# Altium schematic sheet CONNECTOR.SchDoc
size 420 x 297 mm; SheetNumber: 2; SheetTotal: 4
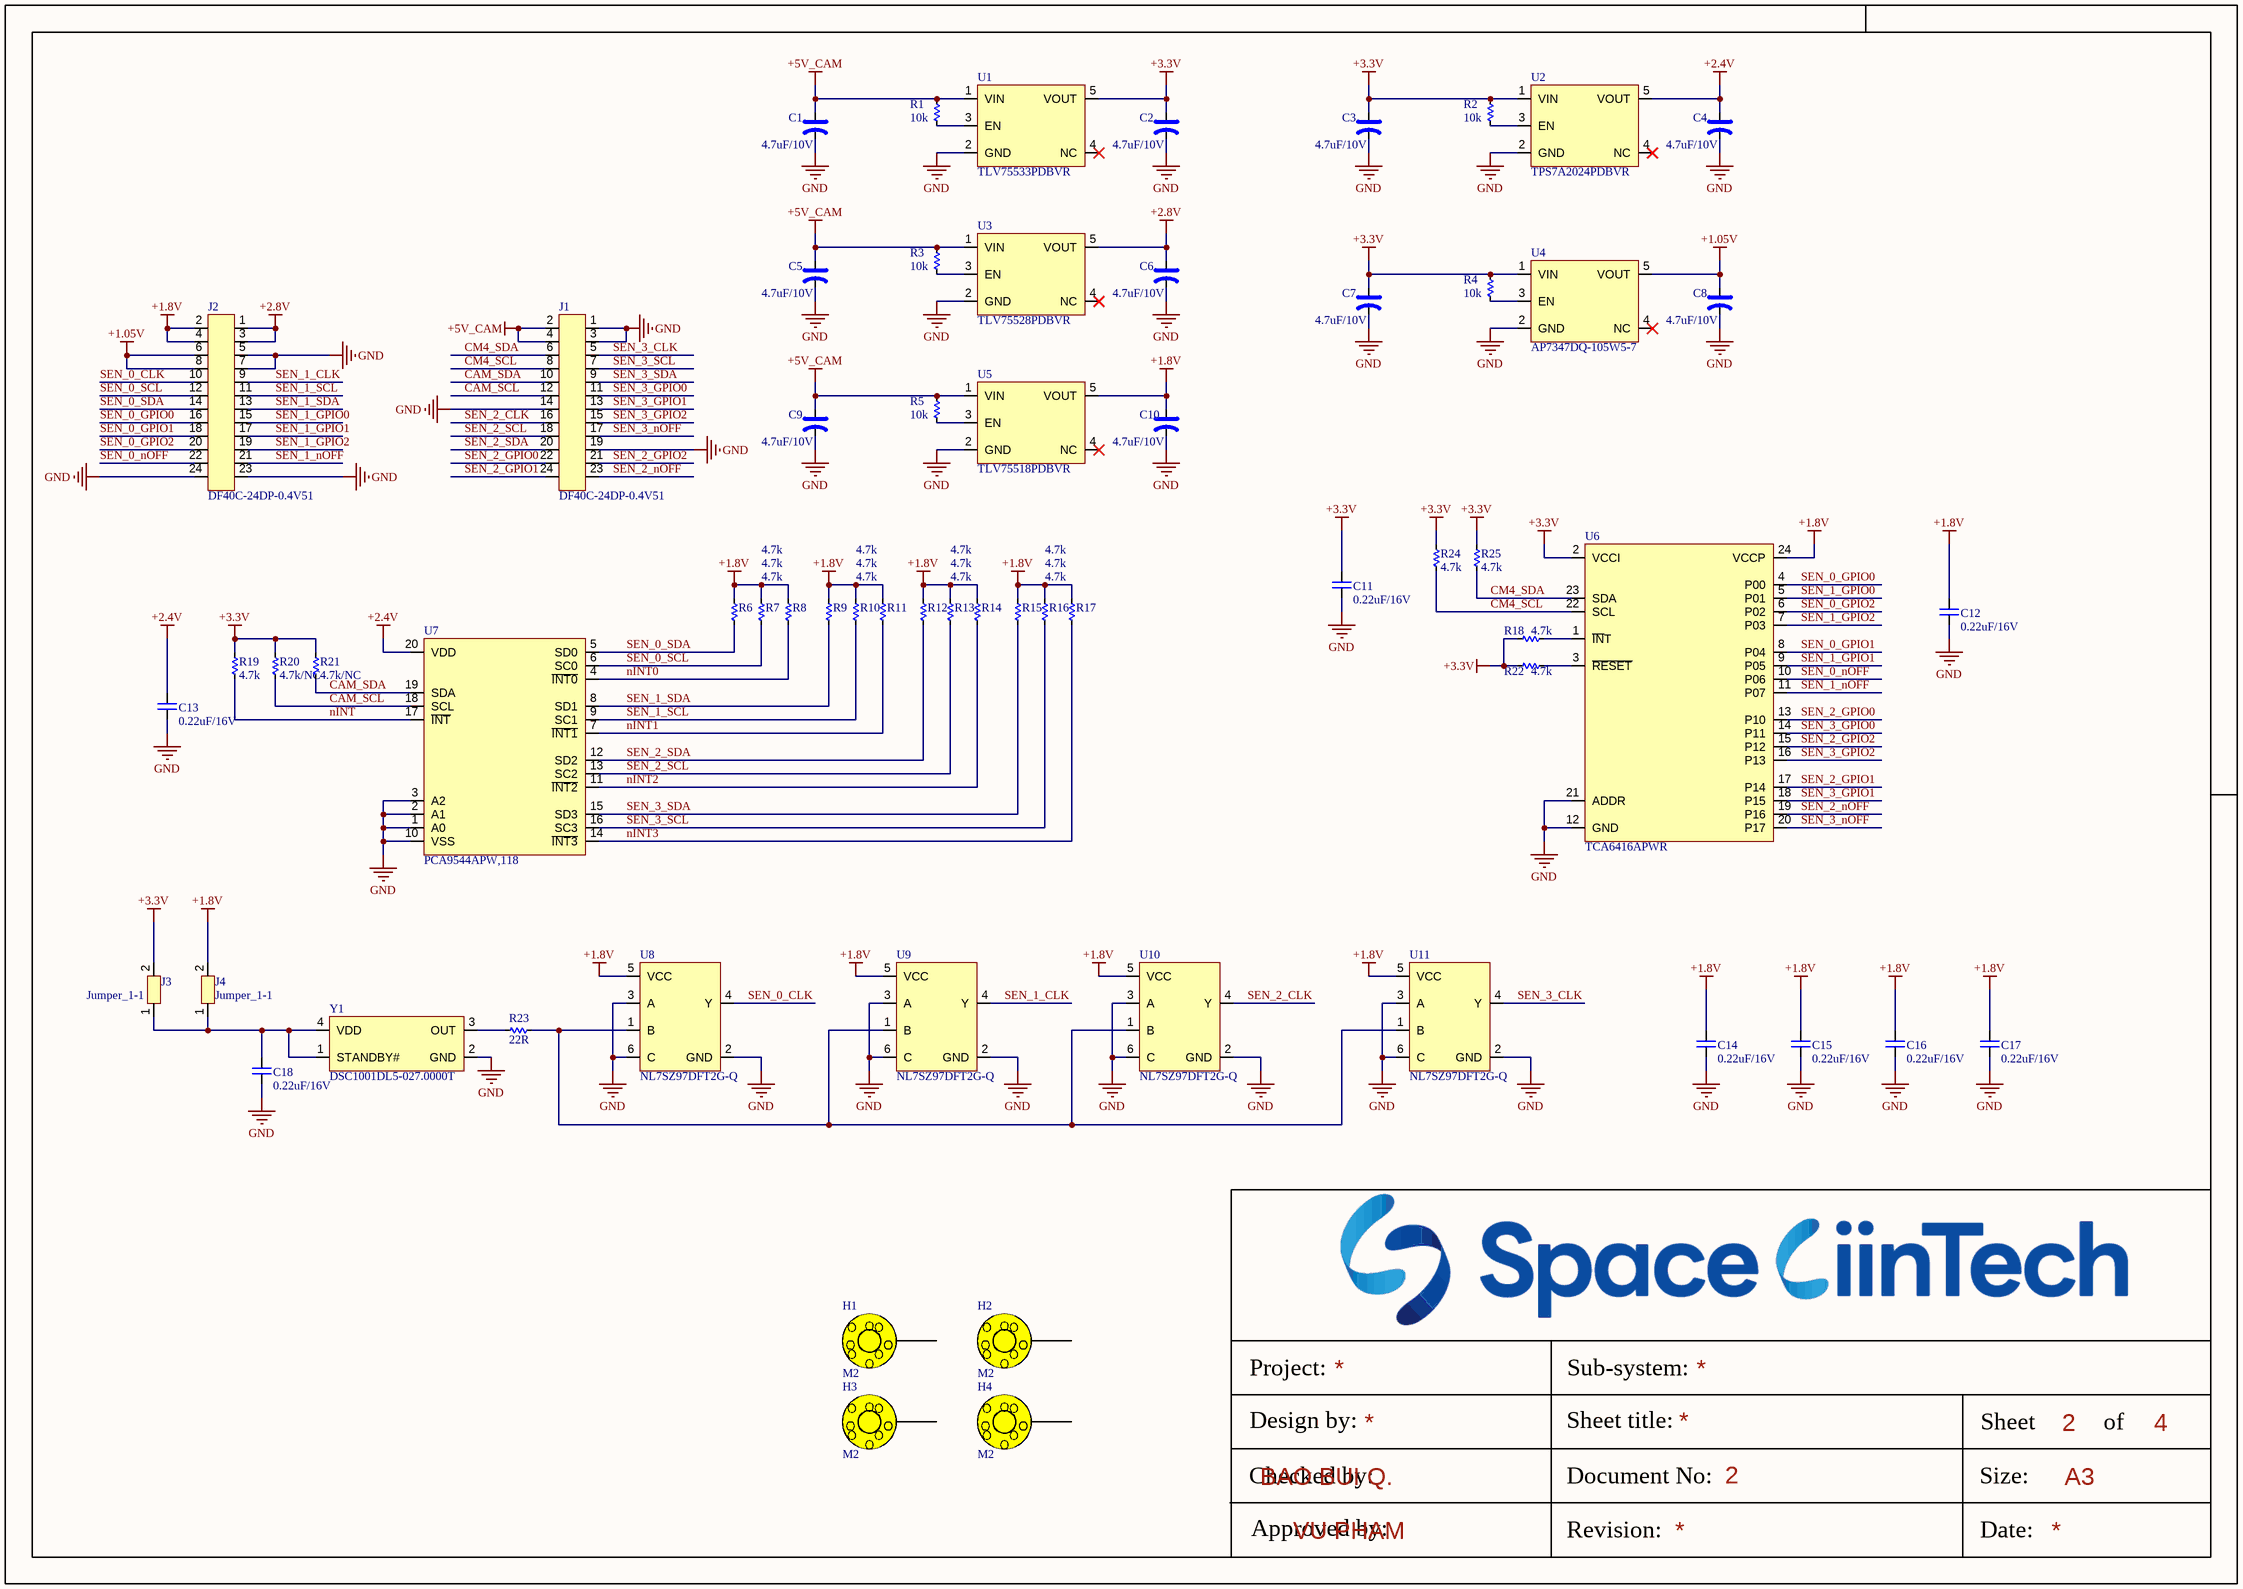
[diagram p0: CONNECTOR.SchDoc]

## Parts
C1  4.7uF/10V  [CAP_MP_1608X90]
C2  4.7uF/10V  [CAP_MP_1608X90]
C3  4.7uF/10V  [CAP_MP_1608X90]
C4  4.7uF/10V  [CAP_MP_1608X90]
C5  4.7uF/10V  [CAP_MP_1608X90]
C6  4.7uF/10V  [CAP_MP_1608X90]
C7  4.7uF/10V  [CAP_MP_1608X90]
C8  4.7uF/10V  [CAP_MP_1608X90]
C9  4.7uF/10V  [CAP_MP_1608X90]
C10  4.7uF/10V  [CAP_MP_1608X90]
C11  0.22uF/16V  [CAP_C_1005X60]
C12  0.22uF/16V  [CAP_C_1005X60]
C13  0.22uF/16V  [CAP_C_1005X60]
C14  0.22uF/16V  [CAP_C_1005X60]
C15  0.22uF/16V  [CAP_C_1005X60]
C16  0.22uF/16V  [CAP_C_1005X60]
C17  0.22uF/16V  [CAP_C_1005X60]
C18  0.22uF/16V  [CAP_C_1005X60]
H1  M2  [HEX-2.2mm]
H2  M2  [HEX-2.2mm]
H3  M2  [HEX-2.2mm]
H4  M2  [HEX-2.2mm]
J1  DF40C-24DP-0.4V51  [CONN24_6p32X1p85_hdr_HIR]
J2  DF40C-24DP-0.4V51  [CONN24_6p32X1p85_hdr_HIR]
J3  Jumper_1-1  [Jumper_1-1]
J4  Jumper_1-1  [Jumper_1-1]
R1  10k  [RES_C_1005X40]
R2  10k  [RES_C_1005X40]
R3  10k  [RES_C_1005X40]
R4  10k  [RES_C_1005X40]
R5  10k  [RES_C_1005X40]
R6  4.7k  [RES_C_1005X40]
R7  4.7k  [RES_C_1005X40]
R8  4.7k  [RES_C_1005X40]
R9  4.7k  [RES_C_1005X40]
R10  4.7k  [RES_C_1005X40]
R11  4.7k  [RES_C_1005X40]
R12  4.7k  [RES_C_1005X40]
R13  4.7k  [RES_C_1005X40]
R14  4.7k  [RES_C_1005X40]
R15  4.7k  [RES_C_1005X40]
R16  4.7k  [RES_C_1005X40]
R17  4.7k  [RES_C_1005X40]
R18  4.7k  [RES_C_1005X40]
R19  4.7k  [RES_C_1005X40]
R20  4.7k/NC  [RES_C_1005X40]
R21  4.7k/NC  [RES_C_1005X40]
R22  4.7k  [RES_C_1005X40]
R23  22R  [RES_C_1005X40]
R24  4.7k  [RES_C_1005X40]
R25  4.7k  [RES_C_1005X40]
U1  TLV75533PDBVR  [SOT25]
U2  TPS7A2024PDBVR  [SOT25]
U3  TLV75528PDBVR  [SOT25]
U4  AP7347DQ-105W5-7  [SOT25]
U5  TLV75518PDBVR  [SOT25]
U6  TCA6416APWR  [SOP65P440W-24N]
U7  PCA9544APW,118  [SOP65P440W_20]
U8  NL7SZ97DFT2G-Q  [SC-88]
U9  NL7SZ97DFT2G-Q  [SC-88]
U10  NL7SZ97DFT2G-Q  [SC-88]
U11  NL7SZ97DFT2G-Q  [SC-88]
Y1  DSC1001DL5-027.0000T  [OSCDFN250X200X89-4N]

## Nets
+1.05V: C8.1 J2.6 J2.8 U4.5(VOUT)
+1.8V: C10.1 C12.2 C14.2 C15.2 C16.2 C17.2 J2.2 J2.4 J4.2 R6.1 R7.1 R8.1 R9.1 R10.1 R11.1 R12.1 R13.1 R14.1 R15.1 R16.1 R17.1 U5.5(VOUT) U6.24(VCCP) U8.5(VCC) U9.5(VCC) U10.5(VCC) U11.5(VCC)
+2.4V: C4.1 C13.2 U2.5(VOUT) U7.20(VDD)
+2.8V: C6.1 J2.1 J2.3 U3.5(VOUT)
+3.3V: C2.1 C3.1 C7.1 C11.2 J3.2 R2.2 R4.2 R18.1 R19.1 R20.1 R21.1 R22.1 R24.1 R25.1 U1.5(VOUT) U2.1(VIN) U4.1(VIN) U6.2(VCCI)
+5V_CAM: C1.1 C5.1 C9.1 J1.2 J1.4 R1.2 R3.2 R5.2 U1.1(VIN) U3.1(VIN) U5.1(VIN)
GND: C1.2 C2.2 C3.2 C4.2 C5.2 C6.2 C7.2 C8.2 C9.2 C10.2 C11.1 C12.1 C13.1 C14.1 C15.1 C16.1 C17.1 C18.1 J1.1 J1.3 J1.14 J1.19 J2.5 J2.7 J2.23 J2.24 U1.2(GND) U2.2(GND) U3.2(GND) U4.2(GND) U5.2(GND) U6.12(GND) U6.21(ADDR) U7.1(A0) U7.2(A1) U7.3(A2) U7.10(VSS) U8.2(GND) U8.3(A) U8.6(C) U9.2(GND) U9.3(A) U9.6(C) U10.2(GND) U10.3(A) U10.6(C) U11.2(GND) U11.3(A) U11.6(C) Y1.2(GND)
CAM_SCL: J1.12 R20.2 U7.18(SCL)
CAM_SDA: J1.10 R21.2 U7.19(SDA)
CM4_SCL: J1.8 R24.2 U6.22(SCL)
CM4_SDA: J1.6 R25.2 U6.23(SDA)
nINT: R19.2 U7.17(~{INT})
nINT0: R8.2 U7.4(~{INT0})
nINT1: R11.2 U7.7(~{INT1})
nINT2: R14.2 U7.11(~{INT2})
nINT3: R17.2 U7.14(~{INT3})
SEN_0_CLK: J2.10 U8.4(Y)
SEN_0_GPIO0: J2.16 U6.4(P00)
SEN_0_GPIO1: J2.18 U6.8(P04)
SEN_0_GPIO2: J2.20 U6.6(P02)
SEN_0_nOFF: J2.22 U6.10(P06)
SEN_0_SCL: J2.12 R7.2 U7.6(SC0)
SEN_0_SDA: J2.14 R6.2 U7.5(SD0)
SEN_1_CLK: J2.9 U9.4(Y)
SEN_1_GPIO0: J2.15 U6.5(P01)
SEN_1_GPIO1: J2.17 U6.9(P05)
SEN_1_GPIO2: J2.19 U6.7(P03)
SEN_1_nOFF: J2.21 U6.11(P07)
SEN_1_SCL: J2.11 R10.2 U7.9(SC1)
SEN_1_SDA: J2.13 R9.2 U7.8(SD1)
SEN_2_CLK: J1.16 U10.4(Y)
SEN_2_GPIO0: J1.22 U6.13(P10)
SEN_2_GPIO1: J1.24 U6.17(P14)
SEN_2_GPIO2: J1.21 U6.15(P12)
SEN_2_nOFF: J1.23 U6.19(P16)
SEN_2_SCL: J1.18 R13.2 U7.13(SC2)
SEN_2_SDA: J1.20 R12.2 U7.12(SD2)
SEN_3_CLK: J1.5 U11.4(Y)
SEN_3_GPIO0: J1.11 U6.14(P11)
SEN_3_GPIO1: J1.13 U6.18(P15)
SEN_3_GPIO2: J1.15 U6.16(P13)
SEN_3_nOFF: J1.17 U6.20(P17)
SEN_3_SCL: J1.7 R16.2 U7.16(SC3)
SEN_3_SDA: J1.9 R15.2 U7.15(SD3)
NetC18_2: C18.2 J3.1 J4.1 Y1.1(STANDBY#) Y1.4(VDD)
NetR1_1: R1.1 U1.3(EN)
NetR2_1: R2.1 U2.3(EN)
NetR3_1: R3.1 U3.3(EN)
NetR4_1: R4.1 U4.3(EN)
NetR5_1: R5.1 U5.3(EN)
NetR18_2: R18.2 U6.1(~{IN}T)
NetR22_2: R22.2 U6.3(~{RESET})
NetR23_1: R23.1 U8.1(B) U9.1(B) U10.1(B) U11.1(B)
NetR23_2: R23.2 Y1.3(OUT)

Not connected (* = marked no-connect by the designer): H1 1; H2 1; H3 1; H4 1; U1 4(NC)*; U2 4(NC)*; U3 4(NC)*; U4 4(NC)*; U5 4(NC)*

## Notes on the sheet
- Project:
- Sub-system:
- Design by:
- BAO BUI Q.
- Sheet title:
- Sheet
- A3
- of
- Checked by:
- Approved by:
- VU PHAM
- Revision:
- Document No:
- Size:
- Date:

## Library data of the parts
C1-C10 = CAP_TH: CAP_Polarization; Published: 8-Jun-2000; LatestRevisionDate: 17-Jul-2002; LatestRevisionNote: Re-released for DXP Platform.; PackageReference: POLAR0.8; Publisher: Altium Limited
C11-C18 = CAP_SMD: CAP_Chip; Value: 33pF
H1-H4 = HEX-M3
J1 J2 = DF40C-24DP-0.4V51: No Description Available; Mfr_Name: Hirose; RefDes: RefDes; Type: Type
J3 J4 = Jumper_1_1
R1-R25 = RES-SMD: RES-Chip; Manufacturer: Generic Components; Class: Passive; Published: 08/06/2000; Publisher: Altium Hobart Technology Centre
U1-U5 = IC_POWER_AP7347DQ
U6 = IC_I2Cto16IO_TCA6416APWR
U7 = IC_I2CSW1to4_PCA9544APW,118
U8-U11 = IC_FLEXLOGIC_NL7SZ97DFT2G-Q
Y1 = Y_OSC27MHz_DSC1001DL5-027.0000T